# EAGLE design Bteam_Mother (EAGLE 6.2)
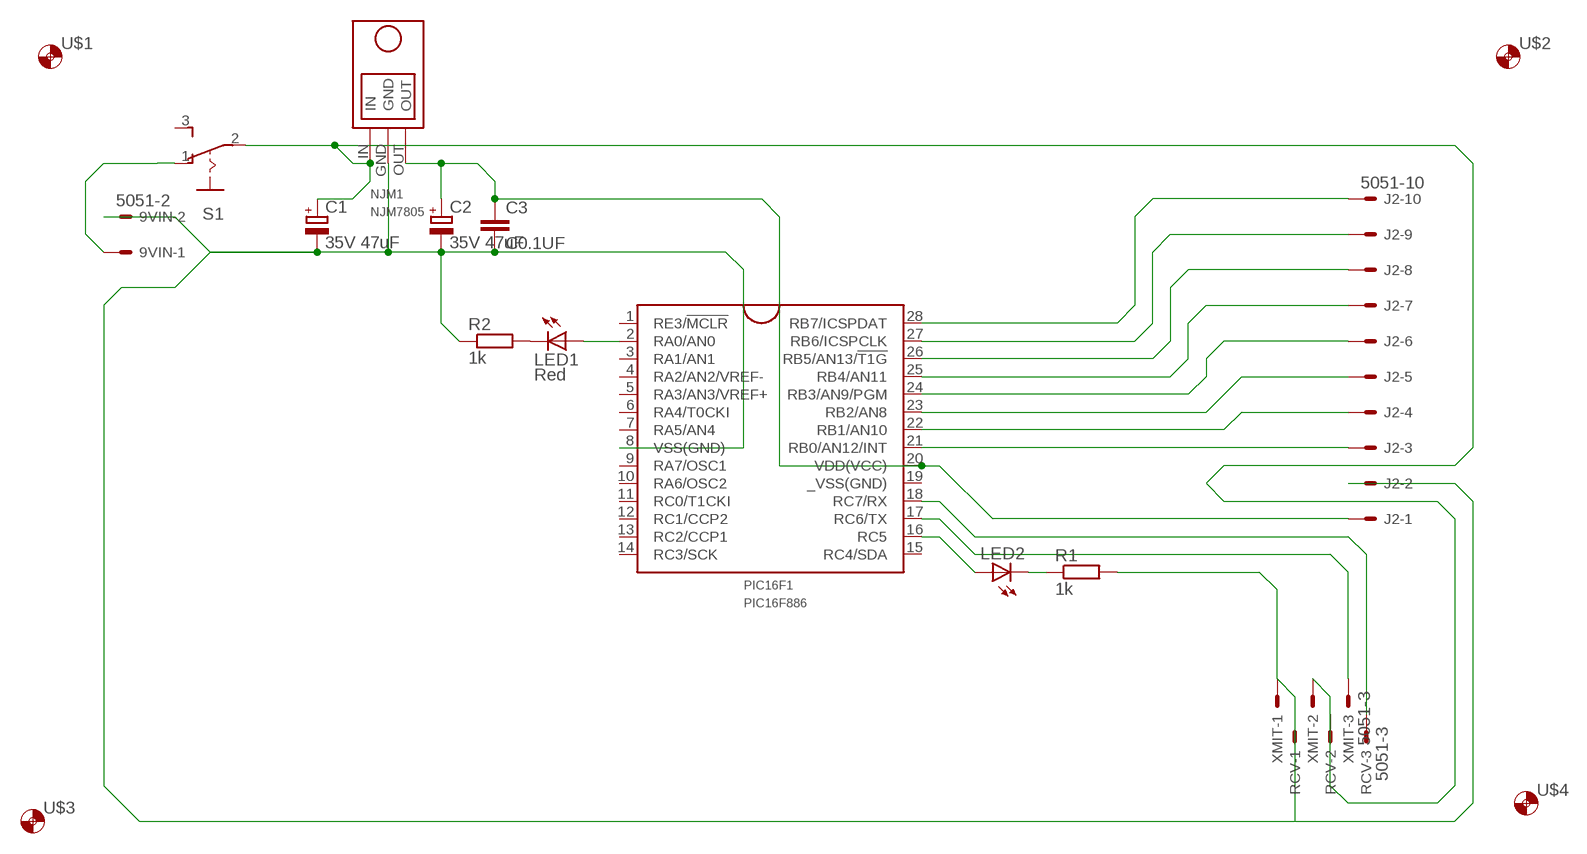
[diagram p0: schematic, sheet 1]

## Parts
9VIN  5051-2  [2PL]
C1  35V 47uF  CPOL-EU2-5MM  [E2-5]
C2  35V 47uF  CPOL-EU2-5MM  [E2-5]
C3  C0.1UF  [C0.1UF]
J2  5051-10  [10PL]
LED1  Red  LED5MM  [LED5MM]
LED2  LED5MM  [LED5MM]
NJM1  NJM7805  [NJM7805]
PIC16F1  PIC16F886  [DIL28-3]
R1  1k  R-EU2R0207/10  [0207/10]
R2  1k  R-EU2R0207/10  [0207/10]
RCV  5051-3  [3PL]
S1  SLIDESW  [SLIDESW]
U$1  1MMDRILL  [1MDRILL]
U$2  1MMDRILL  [1MDRILL]
U$3  1MMDRILL  [1MDRILL]
U$4  1MMDRILL  [1MDRILL]
XMIT  5051-3  [3PL]

## Nets
N$1: C2.+ C3.1 J2.1 NJM1.OUT PIC16F1.20(VDD(VCC))
N$3: C1.+ NJM1.IN RCV.2 S1.2 XMIT.2
N$4: J2.3 PIC16F1.21(RB0/AN12/INT)
N$5: LED1.K(C) R2.2
N$6: LED2.A PIC16F1.16(RC5)
N$7: PIC16F1.17(RC6/TX) XMIT.3
N$8: 9VIN.2 C1.- C2.- C3.2 J2.2 NJM1.GND PIC16F1.8(VSS(GND)) R1.2 R2.1 RCV.1 XMIT.1
N$9: J2.4 PIC16F1.22(RB1/AN10)
N$10: J2.5 PIC16F1.23(RB2/AN8)
N$11: J2.8 PIC16F1.26(RB5/AN13/!T1G)
N$12: PIC16F1.18(RC7/RX) RCV.3
N$13: J2.7 PIC16F1.25(RB4/AN11)
N$14: LED2.K(C) R1.1
N$15: J2.6 PIC16F1.24(RB3/AN9/PGM)
N$16: J2.9 PIC16F1.27(RB6/ICSPCLK)
N$17: J2.10 PIC16F1.28(RB7/ICSPDAT)
N$21: 9VIN.1 S1.1
RED: LED1.A PIC16F1.2(RA0/AN0)
Unconnected: PIC16F1.1(RE3/!MCLR) PIC16F1.3(RA1/AN1) PIC16F1.4(RA2/AN2/VREF-) PIC16F1.5(RA3/AN3/VREF+) PIC16F1.6(RA4/T0CKI) PIC16F1.7(RA5/AN4) PIC16F1.9(RA7/OSC1) PIC16F1.10(RA6/OSC2) PIC16F1.11(RC0/T1CKI) PIC16F1.12(RC1/CCP2) PIC16F1.13(RC2/CCP1) PIC16F1.14(RC3/SCK) PIC16F1.15(RC4/SDA) S1.3

## Power pins joined to a net without a drawn wire
_VSS(GND): PIC16F1.19(_VSS(GND))

## Library data of the parts
9VIN = 5051:5051-2
C1 C2 = FP-21T for MITS:CPOL-EU2
C3 = FP-21T for MITS:C0.1UF
J2 = 5051:5051-10
LED1 LED2 = FP-21T for MITS:LED: LED OSRAM: - CHIPLED LG R971, LG N971, LY N971, LG Q971, LY Q971, LO R971, LY R971 LH N974, LH R974 LS Q976, LO Q976, LY Q976 LO Q996 - Hyper CHIPLED LW Q18S LB Q993, LB Q99A, LB R99A - SideLED LS A670, LO A670, LY A670, LG A670, LP A670 LB A673, LV A673, LT A673, LW A673 LH A674 LY A675 LS A676, LA A676, LO A676, LY A676, LW A676 LS A679, LY A679, LG A679 - Hyper Micro SIDELED® LS Y876, LA Y876, LO Y876, LY Y876 LT Y87S - SmartLED LW L88C, LW L88S LB L89C, LB L89S, LG L890 LS L89K, LO L89K, LY L89K LS L896, LA L896, LO L896, LY L896 - TOPLED LS T670, LO T670, LY T670, LG T670, LP T670 LSG T670, LSP T670, LSY T670, LOP T670, LYG T670 LG T671, LOG T671, LSG T671 LB T673, LV T673, LT T673, LW T673 LH T674 LS T676, LA T676, LO T676, LY T676, LB T676, LH T676, LSB T676, LW T676 LB T67C, LV T67C, LT T67C, LS T67K, LO T67K, LY T67K, LW E67C LS E67B, LA E67B, LO E67B, LY E67B, LB E67C, LV E67C, LT E67C LW T67C LS T679, LY T679, LG T679 LS T770, LO T770, LY T770, LG T770, LP T770 LB T773, LV T773, LT T773, LW T773 LH T774 LS E675, LA E675, LY E675, LS T675 LS T776, LA T776, LO T776, LY T776, LB T776 LHGB T686 LT T68C, LB T68C - Hyper Mini TOPLED® LB M676 - Mini TOPLED Santana® LG M470 LS M47K, LO M47K, LY M47K Source: http://www.osram.convergy.de - LUMILED® LXK2-PW12-R00, LXK2-PW12-S00, LXK2-PW14-U00, LXK2-PW14-V00 LXK2-PM12-R00, LXK2-PM12-S00, LXK2-PM14-U00 LXK2-PE12-Q00, LXK2-PE12-R00, LXK2-PE12-S00, LXK2-PE14-T00, LXK2-PE14-U00 LXK2-PB12-K00, LXK2-PB12-L00, LXK2-PB12-M00, LXK2-PB14-N00, LXK2-PB14-P00, LXK2-PB14-Q00 LXK2-PR12-L00, LXK2-PR12-M00, LXK2-PR14-Q00, LXK2-PR14-R00 LXK2-PD12-Q00, LXK2-PD12-R00, LXK2-PD12-S00 LXK2-PH12-R00, LXK2-PH12-S00 LXK2-PL12-P00, LXK2-PL12-Q00, LXK2-PL12-R00 Source: www.luxeon.com
NJM1 = My_NJM7805:NJM7805
PIC16F1 = FixLib:PIC16F886
R1 R2 = FP-21T for MITS:R-EU2
RCV XMIT = 5051:5051-3
S1 = switch:SLIDESW
U$1-U$4 = Orig_Lib:1MMDRILL

## Board
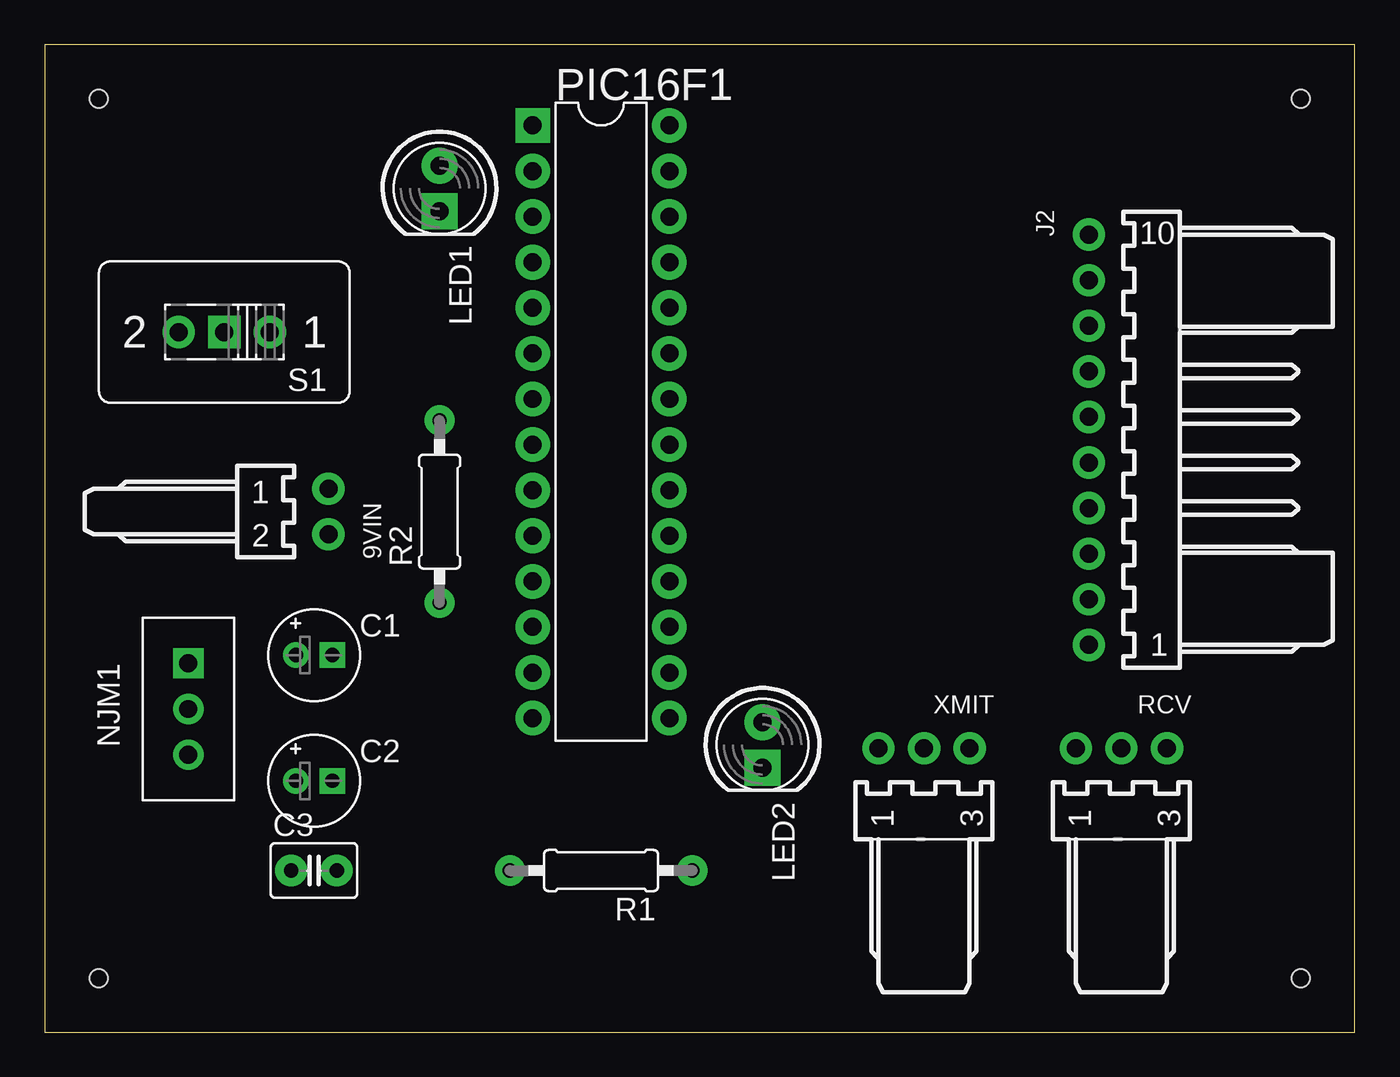
[diagram p1: board, top side]
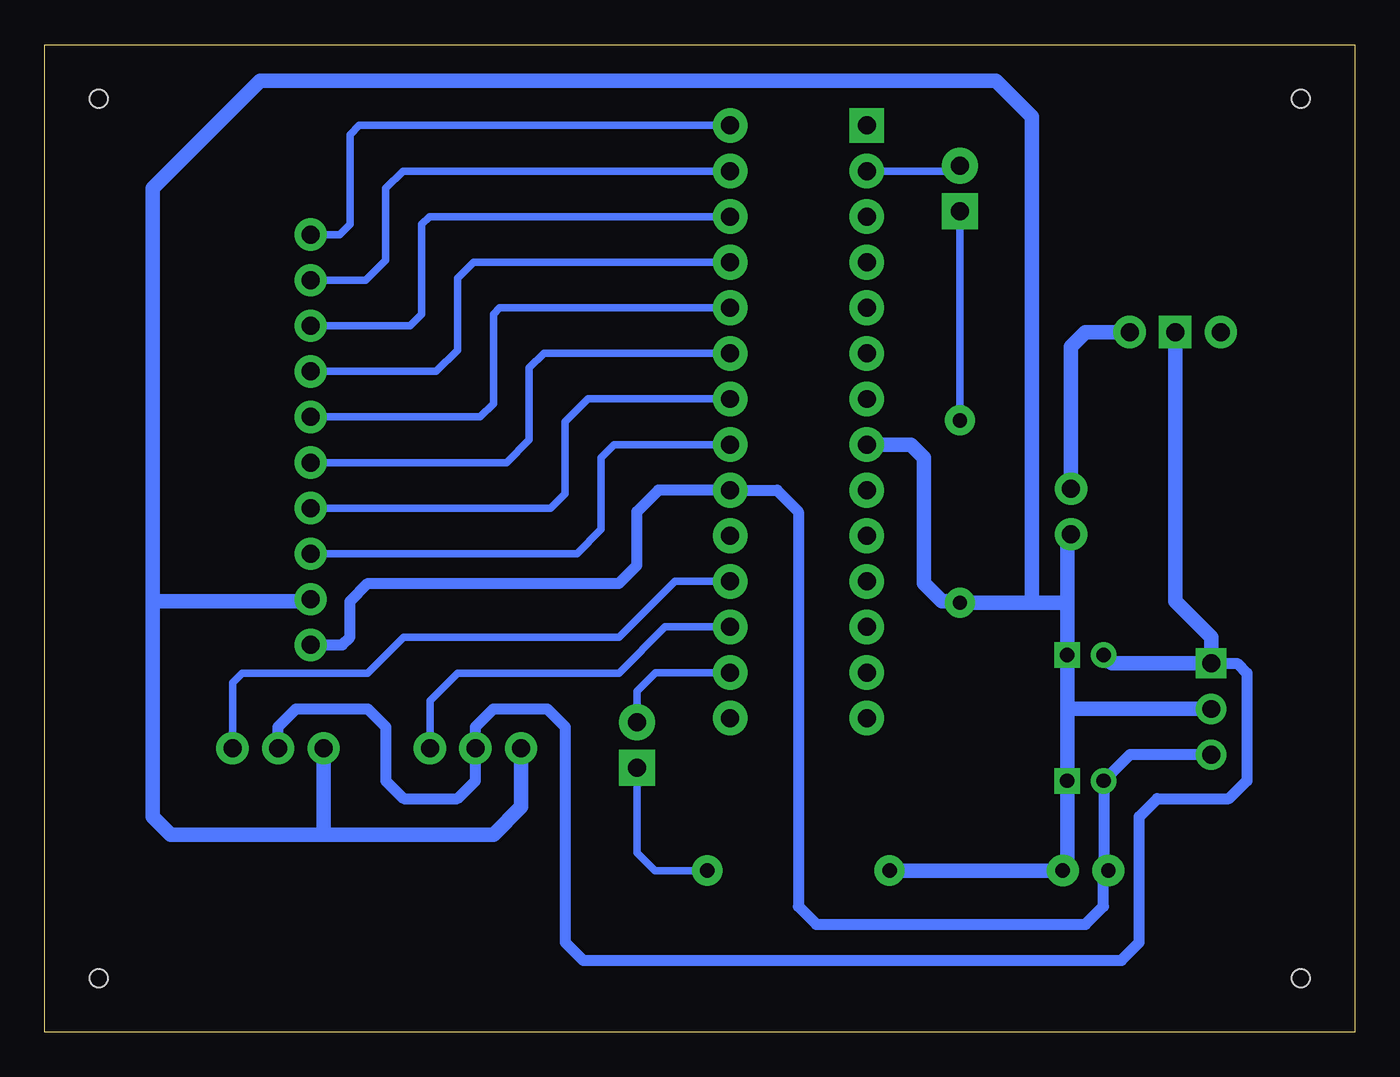
[diagram p2: board, bottom side, seen from below]

Size 73 x 55 mm. Coordinates in mm from the lower left corner, seen from the top.
Outline: 0,0 73,0 73,55 0,55 0,0
Copper layers (1*16): Top 0.035mm / dielectric 1.5mm / Bottom 0.035mm
Design rules: minimum track width 10mil, minimum drill 24mil, track to track 8mil, track to pad 8mil, pad to pad 8mil, via to via 8mil, smd to smd 8mil, copper to edge 40mil, drill to drill 8mil, minimum pad ring 10mil, minimum via ring 8mil, stop-mask expansion 4mil, vias tented up to drill 0mil, thermal gap 10mil

### Footprints (pad centres in the part's own frame; a part is rotated, then mirrored left to right if it is on the bottom)
2PL = drill 1 pad 1.8: 1 -1.27,3.81; 2 1.27,3.81
E2-5 = drill 0.8 pad 1.422: + -1.016,0 | drill 0.8 pad 1.422 square: - 1.016,0
C0.1UF = drill 0.8 pad 1.778: 1 -1.27,0; 2 1.27,0
10PL = drill 1 pad 1.8: 1 -11.43,3.81; 2 -8.89,3.81; 3 -6.35,3.81; 4 -3.81,3.81; 5 -1.27,3.81; 6 1.27,3.81; 7 3.81,3.81; 8 6.35,3.81; 9 8.89,3.81; 10 11.43,3.81
LED5MM = drill 1 pad 2: A -1.27,0 | drill 1 pad 2 square: K 1.27,0
NJM7805 = drill 1 pad 1.676: GND 0,0; OUT 2.54,0 | drill 1 pad 1.676 square: IN -2.54,0
DIL28-3 = drill 1 pad 1.93 square: 1 -16.51,-3.81 | drill 1 pad 1.93: 2 -13.97,-3.81; 3 -11.43,-3.81; 4 -8.89,-3.81; 5 -6.35,-3.81; 6 -3.81,-3.81; 7 -1.27,-3.81; 8 1.27,-3.81; 9 3.81,-3.81; 10 6.35,-3.81; 11 8.89,-3.81; 12 11.43,-3.81; 13 13.97,-3.81; 14 16.51,-3.81; 15 16.51,3.81; 16 13.97,3.81; 17 11.43,3.81; 18 8.89,3.81; 19 6.35,3.81; 20 3.81,3.81; 21 1.27,3.81; 22 -1.27,3.81; 23 -3.81,3.81; 24 -6.35,3.81; 25 -8.89,3.81; 26 -11.43,3.81; 27 -13.97,3.81; 28 -16.51,3.81
0207/10 = drill 0.8 pad 1.676: 1 -5.08,0; 2 5.08,0
3PL = drill 1 pad 1.8: 1 -2.54,3.81; 2 0,3.81; 3 2.54,3.81
SLIDESW = drill 1 pad 1.8: 1 -2.54,0; 3 2.54,0 | drill 1 pad 1.8 square: 2 0,0
1MDRILL = hole 1: 0,0

### Placement (x,y rotation side)
9VIN  12,29 270 top
C1  15,21 0 top
C2  15,14 0 top
C3  15,9 0 top
J2  62,33 90 top
LED1  22,47 270 top
LED2  40,16 270 top
NJM1  8,18 270 top
PIC16F1  31,34 270 top
R1  31,9 180 top
R2  22,29 90 top
RCV  60,12 0 top
S1  10,39 180 top
U$1  3,3 0 top
U$2  70,3 0 top
U$3  3,52 0 top
U$4  70,52 0 top
XMIT  49,12 0 top

### Tracks (layer width: path | path; a pad name or v marks a point on that pad's centre or on a via)
N$1
  Bottom 0.61: J2.1 56.43,21.57 56,22 56,24 55,25 41,25 40,26 40,29 38.81,30.19 PIC16F1.20 32.19,30.19 31,29 31,7 30,6 15,6 14,7 14,8.73 C3.1 13.98,9.25 C2.+ 12.52,15.46 NJM1.OUT
N$3
  Bottom 0.61: RCV.2 60,17 59,18 55,18 54,17 54,14 53,13 50,13 49,14 XMIT.2 49,17 48,18 45,18 44,17 44,5 43,4 13,4 12,5 12,12 11,13 7,13 6,14 6,20 6.54,20.54 NJM1.IN
  Bottom 0.813: S1.2 10,24 8,22 NJM1.IN 13.52,20.54 C1.+
N$4
  Bottom 0.406: PIC16F1.21 41.27,32.73 42,32 42,28 43.35,26.65 J2.3
N$5
  Bottom 0.406: LED1.K R2.2
N$6
  Bottom 0.406: PIC16F1.16 38.97,20.03 40,19 LED2.A
N$7
  Bottom 0.406: PIC16F1.17 38.43,22.57 41,20 50,20 51.54,18.46 XMIT.3
N$8
  Bottom 0.813: XMIT.1 46.46,12.54 48,11 57,11 | 57,11 66,11 67,12 67,24 | 67,24 67,47 61,53 20,53 18,51 18,24 18,23.92 | 18,23.92 R2.1 22.08,24 23,24 24,25 24,32 24.73,32.73 PIC16F1.8 | 18,23.92 16.08,23.92 16,24 | 16,24 16,21.02 C1.- 16.02,18 | 16.02,18 C2.- 16.02,9.25 C3.2 R1.2 | 16,24 16,27.54 9VIN.2 | J2.2 58.19,24 67,24 | NJM1.GND 16.02,18 | RCV.1 57.46,11 57,11
N$9
  Bottom 0.406: PIC16F1.22 42.73,35.27 44,34 44,30 44.81,29.19 J2.4
N$10
  Bottom 0.406: PIC16F1.23 45.19,37.81 46,37 46,33 47.27,31.73 J2.5
N$11
  Bottom 0.406: PIC16F1.26 51.57,45.43 52,45 52,40 52.65,39.35 J2.8
N$12
  Bottom 0.406: PIC16F1.18 37.89,25.11 41,22 53,22 55,20 62,20 62.54,19.46 RCV.3
N$13
  Bottom 0.406: PIC16F1.25 49.11,42.89 50,42 50,38 51.19,36.81 J2.7
N$14
  Bottom 0.406: LED2.K 40,10 39,9 R1.1
N$15
  Bottom 0.406: PIC16F1.24 47.65,40.35 48,40 48,35 48.73,34.27 J2.6
N$16
  Bottom 0.406: PIC16F1.27 53.03,47.97 54,47 54,43 55.11,41.89 J2.9
N$17
  Bottom 0.406: PIC16F1.28 55.49,50.51 56,50 56,45 56.57,44.43 J2.10
N$21
  Bottom 0.813: 9VIN.1 15.81,38.19 15,39 S1.1
RED
  Bottom 0.406: PIC16F1.2 22.3,47.97 LED1.A